# EAGLE design 7segement2digits1badidea-mk-3 (EAGLE 6.5.0)
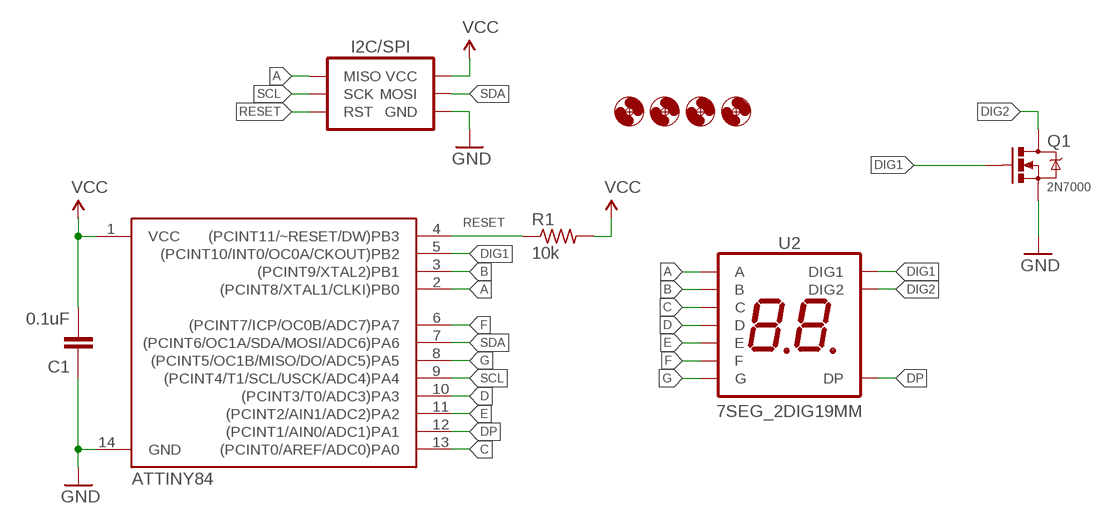
[diagram p0: schematic, sheet 1]

## Parts
C1  0.1uF  CAPACITOR-CERAMIC025-024X044  [C025-024X044]
H1  HOLE#2  [HOLE-#2]
H2  HOLE#2  [HOLE-#2]
H3  HOLE#2  [HOLE-#2]
H4  HOLE#2  [HOLE-#2]
I2C/SPI  AVR_SPI_PRG_6PTH_INLINE_I2C  [AVR_ISP_INLINE_PTH_I2C]
Q1  2N7000  MOSFET-NCHANNEL2N7000-AMMO  [TO-92-AMMO]
R1  10k  RESISTORPTH-AXIAL-7.68MM  [RESISTOR-AXIAL-PTH-7.68MM]
U1  ATTINY84  ATTINY84ATTINY84-20PU  [DIL14]
U2  7SEG_2DIG19MM  [7SEG_2DIG_19MM]

## Nets
A: I2C/SPI.MISO U1.2((PCINT8/XTAL1/CLKI)PB0) U2.10(A)
B: U1.3((PCINT9/XTAL2)PB1) U2.9(B)
C: U1.13((PCINT0/AREF/ADC0)PA0) U2.1(C)
D: U1.10((PCINT3/T0/ADC3)PA3) U2.4(D)
DIG1: Q1.2(G) U1.5((PCINT10/INT0/OC0A/CKOUT)PB2) U2.8(DIG1)
DIG2: Q1.3(D) U2.7(DIG2)
DP: U1.12((PCINT1/AIN0/ADC1)PA1) U2.2(DP)
E: U1.11((PCINT2/AIN1/ADC2)PA2) U2.3(E)
F: U1.6((PCINT7/ICP/OC0B/ADC7)PA7) U2.6(F)
G: U1.8((PCINT5/OC1B/MISO/DO/ADC5)PA5) U2.5(G)
GND: C1.1 I2C/SPI.GND Q1.1(S) U1.14(GND)
RESET: I2C/SPI.RESET(RST) R1.P$1 U1.4((PCINT11/~RESET/DW)PB3)
SCL: I2C/SPI.SCK U1.9((PCINT4/T1/SCL/USCK/ADC4)PA4)
SDA: I2C/SPI.MOSI U1.7((PCINT6/OC1A/SDA/MOSI/ADC6)PA6)
VCC: C1.2 I2C/SPI.VCC R1.P$2 U1.1(VCC)

## Library data of the parts
C1 = A_butts:CAPACITOR-CERAMIC: CAPACITOR, European symbol
H1-H4 = A_butts:HOLE: MOUNTING HOLE with drill center marker
I2C/SPI = A_butts:AVR_SPI_PRG_6: AVR ISP 6 Pin This is the reduced ISP connector for AVR programming. Common on Arduino. This footprint will take up less PCB space and can be used with a 10-pin to 6-pin adapter such as SKU: BOB-08508 **Special note about "TEST_POINT" package. The stop mask is on the top side, so if you want your programming test points to be on the bottom of your board, make sure to place this package on the bottom side of the board. This also ensure that the orientation to program from the bottom side will be correct.
Q1 = A_butts:MOSFET-NCHANNEL: Common NMOSFET Parts MFG P/N Store ID Prod ID FDD8780 TRANS-09984 SI7820DN TRANS-11055 FDS6630A IC-08089 2N7002PW TRANS-11151 FQP30N06L COM-10213 TRANS-10060 BSS123LT1G TRANS-08345 BSS138 TRANS-00830 BS170 2N7000
R1 = A_butts:RESISTOR: RESISTOR, American symbol
U1 = A_butts:ATTINY84: Atmel 14-pin 2/4/8kB flash uC
U2 = A_butts:7SEG_2DIG

## Board
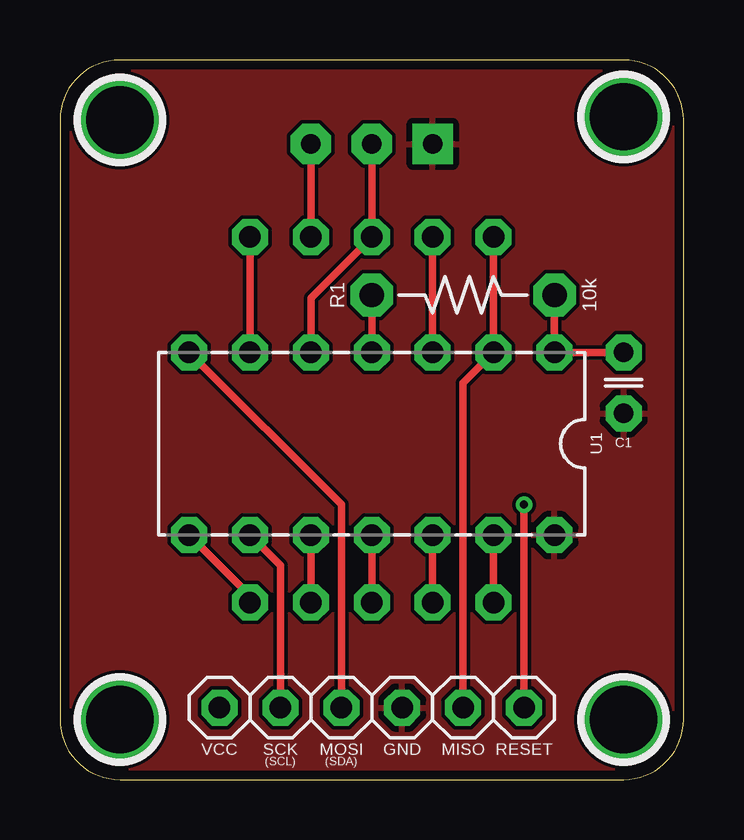
[diagram p1: board, top side]
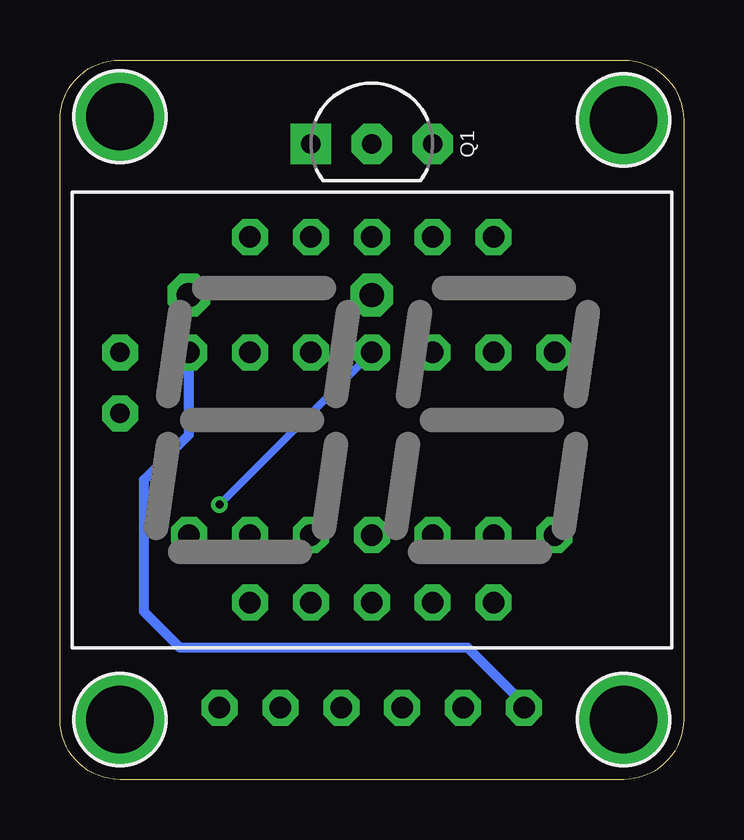
[diagram p2: board, bottom side, seen from below]

Size 26 x 30 mm. Coordinates in mm from the lower left corner, seen from the top.
Outline: 0,27.5 0,2.5 arc90 2.5,0 23.5,0 arc90 26,2.5 26,27.5 arc90 23.5,30 2.5,30 arc90 0,27.5
Copper layers (1*16): Top 0.0356mm / dielectric 1.5011mm / Bottom 0.0356mm
Design rules "LaenPCBOrder_2": minimum track width 6mil, minimum drill 13mil, track to track 6mil, track to pad 6mil, pad to pad 6mil, via to via 6mil, smd to smd 6mil, copper to edge 15mil, drill to drill 6mil, minimum pad ring 7mil, minimum via ring 7mil, stop-mask expansion 3mil, vias tented up to drill 20mil, thermal gap 10mil

### Footprints (pad centres in the part's own frame; a part is rotated, then mirrored left to right if it is on the bottom)
C025-024X044 = drill 0.813 pad 1.5 octagon: 1 -1.27,0; 2 1.27,0
HOLE-#2 = drill 2.8 pad 3.81: P$1 0,0
AVR_ISP_INLINE_PTH_I2C = drill 0.9 pad 1.5 octagon: GND 1.27,0; MISO 3.81,0; MOSI -1.27,0; RESET 6.35,0; SCK -3.81,0; VCC -6.35,0
TO-92-AMMO = drill 0.813 pad 1.676 square: 1 -2.54,0 | drill 0.813 pad 1.676 octagon: 2 0,0; 3 2.54,0
RESISTOR-AXIAL-PTH-7.68MM = drill 1.016 pad 1.778 octagon: P$1 -3.81,0; P$2 3.81,0
DIL14 = drill 0.9 pad 1.5 octagon: 1 -7.62,-3.81; 2 -5.08,-3.81; 3 -2.54,-3.81; 4 0,-3.81; 5 2.54,-3.81; 6 5.08,-3.81; 7 7.62,-3.81; 8 7.62,3.81; 9 5.08,3.81; 10 2.54,3.81; 11 0,3.81; 12 -2.54,3.81; 13 -5.08,3.81; 14 -7.62,3.81
7SEG_2DIG_19MM = drill 0.9 pad 1.5 octagon: 1 -5.08,-7.62; 2 -2.54,-7.62; 3 0,-7.62; 4 2.54,-7.62; 5 5.08,-7.62; 6 5.08,7.62; 7 2.54,7.62; 8 0,7.62; 9 -2.54,7.62; 10 -5.08,7.62

### Placement (x,y rotation side)
C1  23.5,16.54 90 top
H1  23.5,27.63 0 top
H2  2.5,27.5 0 top
H3  23.5,2.5 0 top
H4  2.5,2.5 0 top
I2C/SPI  13,3 0 top
Q1  13,26.5 0 bottom
R1  16.81,20.2 0 top
U1  13,14 180 top
U2  13,15 0 bottom

### Tracks (layer width: path | path; a pad name or v marks a point on that pad's centre or on a via)
A
  Top 0.305: U2.10 U1.2 16.81,16.54 I2C/SPI.MISO
B
  Top 0.305: U1.3 U2.9
C
  Top 0.305: U2.1 U1.13
D
  Top 0.305: U2.4 U1.10
DIG1
  Top 0.305: U1.5 10.46,20.08 U2.8 Q1.2
DIG2
  Top 0.305: U2.7 Q1.3
DP
  Top 0.305: U2.2 U1.12
E
  Top 0.305: U2.3 U1.11
F
  Top 0.305: U1.6 U2.6
G
  Top 0.305: U2.5 7.92,7.65 U1.8
GND
  pour Top: 23.5,0 2.5,0 arc-90 0,2.5 0,27.5 arc-90 2.5,30 23.5,30 arc-90 26,27.5 26,2.5 arc-90
RESET  (via drill 0.33)
  Top 0.305: U1.4 R1.P$1 | I2C/SPI.RESET v19.35,11.46
  Bottom 0.305: v19.35,11.46 U1.4
SCL
  Top 0.305: I2C/SPI.SCK 9.19,8.92 U1.9
SDA
  Top 0.305: I2C/SPI.MOSI 11.73,11.46 U1.7
VCC
  Top 0.305: R1.P$2 U1.1 C1.2
  Bottom 0.406: I2C/SPI.VCC 6.65,3.15 9,5.5 21,5.5 22.5,7 22.5,12.5 20.62,14.38 U1.1